# EAGLE design enoid (EAGLE 9.6.2)
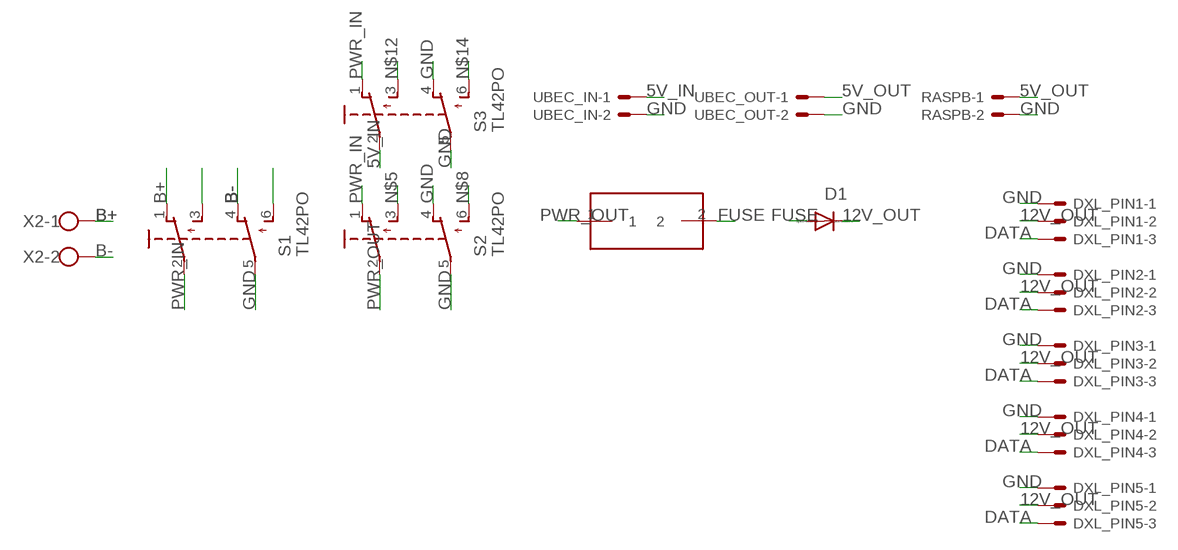
[diagram p0: schematic, sheet 1]

## Parts
D1  BY500  [DO201-15]
DXL_PIN1  22-23-2031  [22-23-2031]
DXL_PIN2  22-23-2031  [22-23-2031]
DXL_PIN3  22-23-2031  [22-23-2031]
DXL_PIN4  22-23-2031  [22-23-2031]
DXL_PIN5  22-23-2031  [22-23-2031]
FUSE  FUSE-30X8  [FUSE]
RASPB  22-23-2021  [22-23-2021]
S1  TL42PO  [TL4XPO]
S2  TL42PO  [TL4XPO]
S3  TL42PO  [TL4XPO]
UBEC_IN  22-23-2021  [22-23-2021]
UBEC_OUT  22-23-2021  [22-23-2021]
X2  W237-102  [W237-102]

## Nets
5V_IN: S3.2(P) UBEC_IN.1
5V_OUT: RASPB.1 UBEC_OUT.1
12V_OUT: D1.C DXL_PIN1.2 DXL_PIN2.2 DXL_PIN3.2 DXL_PIN4.2 DXL_PIN5.2
B+: S1.1(O) X2.1
B-: S1.4(O1) X2.2
DATA: DXL_PIN1.3 DXL_PIN2.3 DXL_PIN3.3 DXL_PIN4.3 DXL_PIN5.3
FUSE: D1.A FUSE.2
GND: DXL_PIN1.1 DXL_PIN2.1 DXL_PIN3.1 DXL_PIN4.1 DXL_PIN5.1 RASPB.2 S1.5(P1) S2.4(O1) S2.5(P1) S3.4(O1) S3.5(P1) UBEC_IN.2 UBEC_OUT.2
N$4: S1.3(S)
N$5: S2.3(S)
N$6: S1.6(S1)
N$8: S2.6(S1)
N$12: S3.3(S)
N$14: S3.6(S1)
PWR_IN: S1.2(P) S2.1(O) S3.1(O)
PWR_OUT: FUSE.1 S2.2(P)

## Library data of the parts
D1 = diode:BY500: DIODE fast recovery diode, 5 A, 800 V
DXL_PIN1-DXL_PIN5 = con-molex:22-23-2031: .100" (2.54mm) Center Header - 3 Pin; MF: MOLEX; MPN: 22-23-2031; OC_FARNELL: 1462950; OC_NEWARK: 30C0862
FUSE = FUSE:FUSE-30X8: FUSE 30x8 mm DIY
RASPB UBEC_IN UBEC_OUT = con-molex:22-23-2021: .100" (2.54mm) Center Header - 2 Pin; MF: MOLEX; MPN: 22-23-2021; OC_FARNELL: 1462926; OC_NEWARK: 25C3832
S1-S3 = switch:TL42PO: TINY SWITCH ON - MOM Source: http://www2.produktinfo.conrad.com/datenblaetter/700000-724999/705152-da-01-de-Subminiaturschalter_TL_36YO.pdf
X2 = con-wago-500:W237-102: WAGO SCREW CLAMP; MPN: 237-102; OC_FARNELL: unknown; OC_NEWARK: 70K9898

## Board
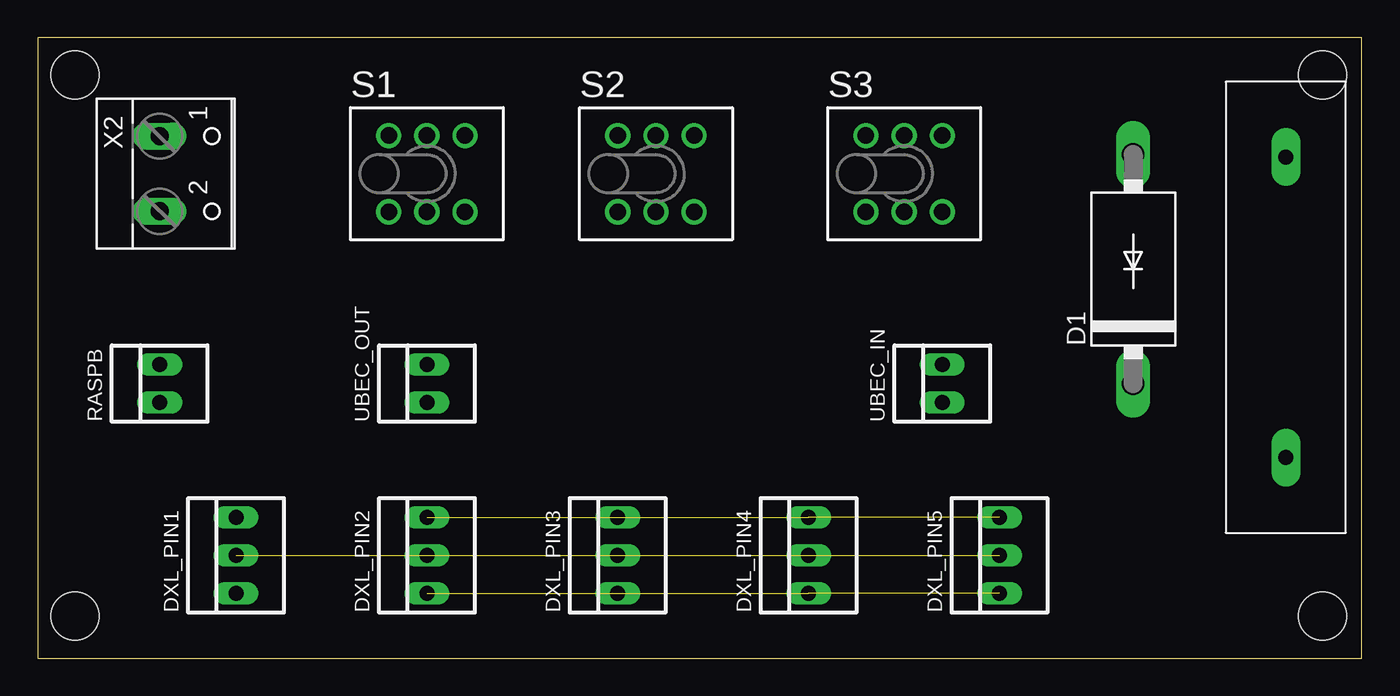
[diagram p1: board, top side]
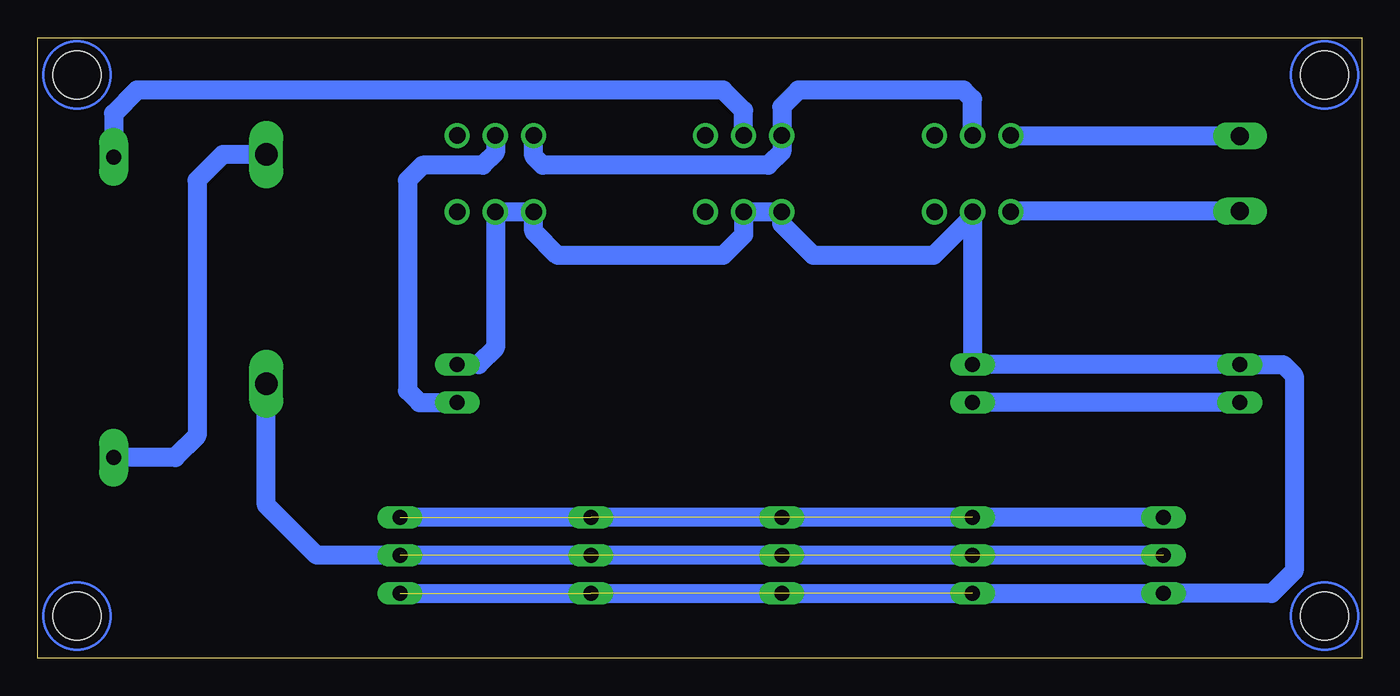
[diagram p2: board, bottom side, seen from below]

Size 88.11 x 41.31 mm. Coordinates in mm from the lower left corner, seen from the top.
Outline: 0,0 88.11,0 88.11,41.31 0,41.31 0,0
Copper layers (1*16): Top 0.035mm / dielectric 1.5mm / Bottom 0.035mm
Design rules "default": minimum track width 6mil, minimum drill 0.35mm, track to track 6mil, track to pad 6mil, pad to pad 6mil, via to via 6mil, smd to smd 6mil, copper to edge 40mil, drill to drill 6mil, minimum pad ring 10mil, minimum via ring 8mil, stop-mask expansion 4mil, vias tented up to drill 0mil, thermal gap 10mil
Holes 3.2 mm at 2.5,2.81 2.5,38.81 85.5,38.81 85.5,2.81

### Footprints (pad centres in the part's own frame; a part is rotated, then mirrored left to right if it is on the bottom)
DO201-15 = drill 1.499 long: A 7.62,0; C -7.62,0
22-23-2031 = drill 1 long: 1 -2.54,0; 2 0,0; 3 2.54,0
FUSE = drill 1 pad 1.93 long: 1 -10,0; 2 10,0
22-23-2021 = drill 1 long: 1 -1.27,0; 2 1.27,0
TL4XPO = drill 1.1 pad 1.676: 1 -2.54,2.54; 2 0,2.54; 3 2.54,2.54; 4 -2.54,-2.54; 5 0,-2.54; 6 2.54,-2.54
W237-102 = drill 1.194 long: 1 -2.5,-1.27; 2 2.5,-1.27

### Placement (x,y rotation side)
D1  72.89,25.9 90 top
DXL_PIN1  13.2,6.85 90 top
DXL_PIN2  25.9,6.85 90 top
DXL_PIN3  38.6,6.85 90 top
DXL_PIN4  51.3,6.85 90 top
DXL_PIN5  64,6.85 90 top
FUSE  83.05,23.36 270 top
RASPB  8.12,18.28 90 top
S1  25.9,32.25 0 top
S2  41.14,32.25 0 top
S3  57.65,32.25 0 top
UBEC_IN  60.19,18.28 90 top
UBEC_OUT  25.9,18.28 90 top
X2  9.39,32.25 270 top

### Tracks (layer width: path | path; a pad name or v marks a point on that pad's centre or on a via)
5V_IN
  Bottom 1.27: S3.2 57.65,33.66 58.5,32.81 62.5,32.81 63.5,31.81 63.5,17.81 62.7,17.01 UBEC_IN.1
5V_OUT
  Bottom 1.27: RASPB.1 UBEC_OUT.1
12V_OUT  (4 unrouted)
  Bottom 1.27: DXL_PIN1.2 69.54,6.85 72.89,10.2 D1.C
B+
  Bottom 0.508: 23.32,34.75 S1.1
  Bottom 1.27: X2.1 23.32,34.75
B-
  Bottom 1.27: X2.2 23.32,29.75 S1.4
DATA  (3 unrouted)
  Bottom 1.27: DXL_PIN1.3 DXL_PIN5.3
FUSE
  Bottom 1.27: D1.A 75.79,33.52 77.5,31.81 77.5,14.81 78.95,13.36 FUSE.2
GND  (3 unrouted)
  Bottom 0.508: 13.5,4.31 DXL_PIN1.1 12.5,4.31
  Bottom 1.27: DXL_PIN5.1 13.5,4.31 12.5,4.31 6,4.31 4.5,5.81 4.5,18.81 5.24,19.55 RASPB.2 UBEC_OUT.2 S1.5 25.9,29.41 28.5,26.81 36.5,26.81 38.6,28.91 S2.4 S2.5 41.14,28.17 42.5,26.81 53.5,26.81 55.11,28.42 S3.4 S3.5 57.65,20.66 58.76,19.55 UBEC_IN.2
PWR_IN
  Bottom 1.27: S1.2 25.9,37.21 26.5,37.81 37.5,37.81 38.6,36.71 S2.1 38.6,33.71 39.5,32.81 54.5,32.81 55.11,33.42 S3.1
PWR_OUT
  Bottom 1.27: S2.2 41.14,36.45 42.5,37.81 81.5,37.81 83.05,36.26 FUSE.1
(copper drawn outside any net)
  shapes: Bottom circle x4